# EAGLE design basic-inline-turbidimeter_rtc_board_v1 (EAGLE 7.7.0)
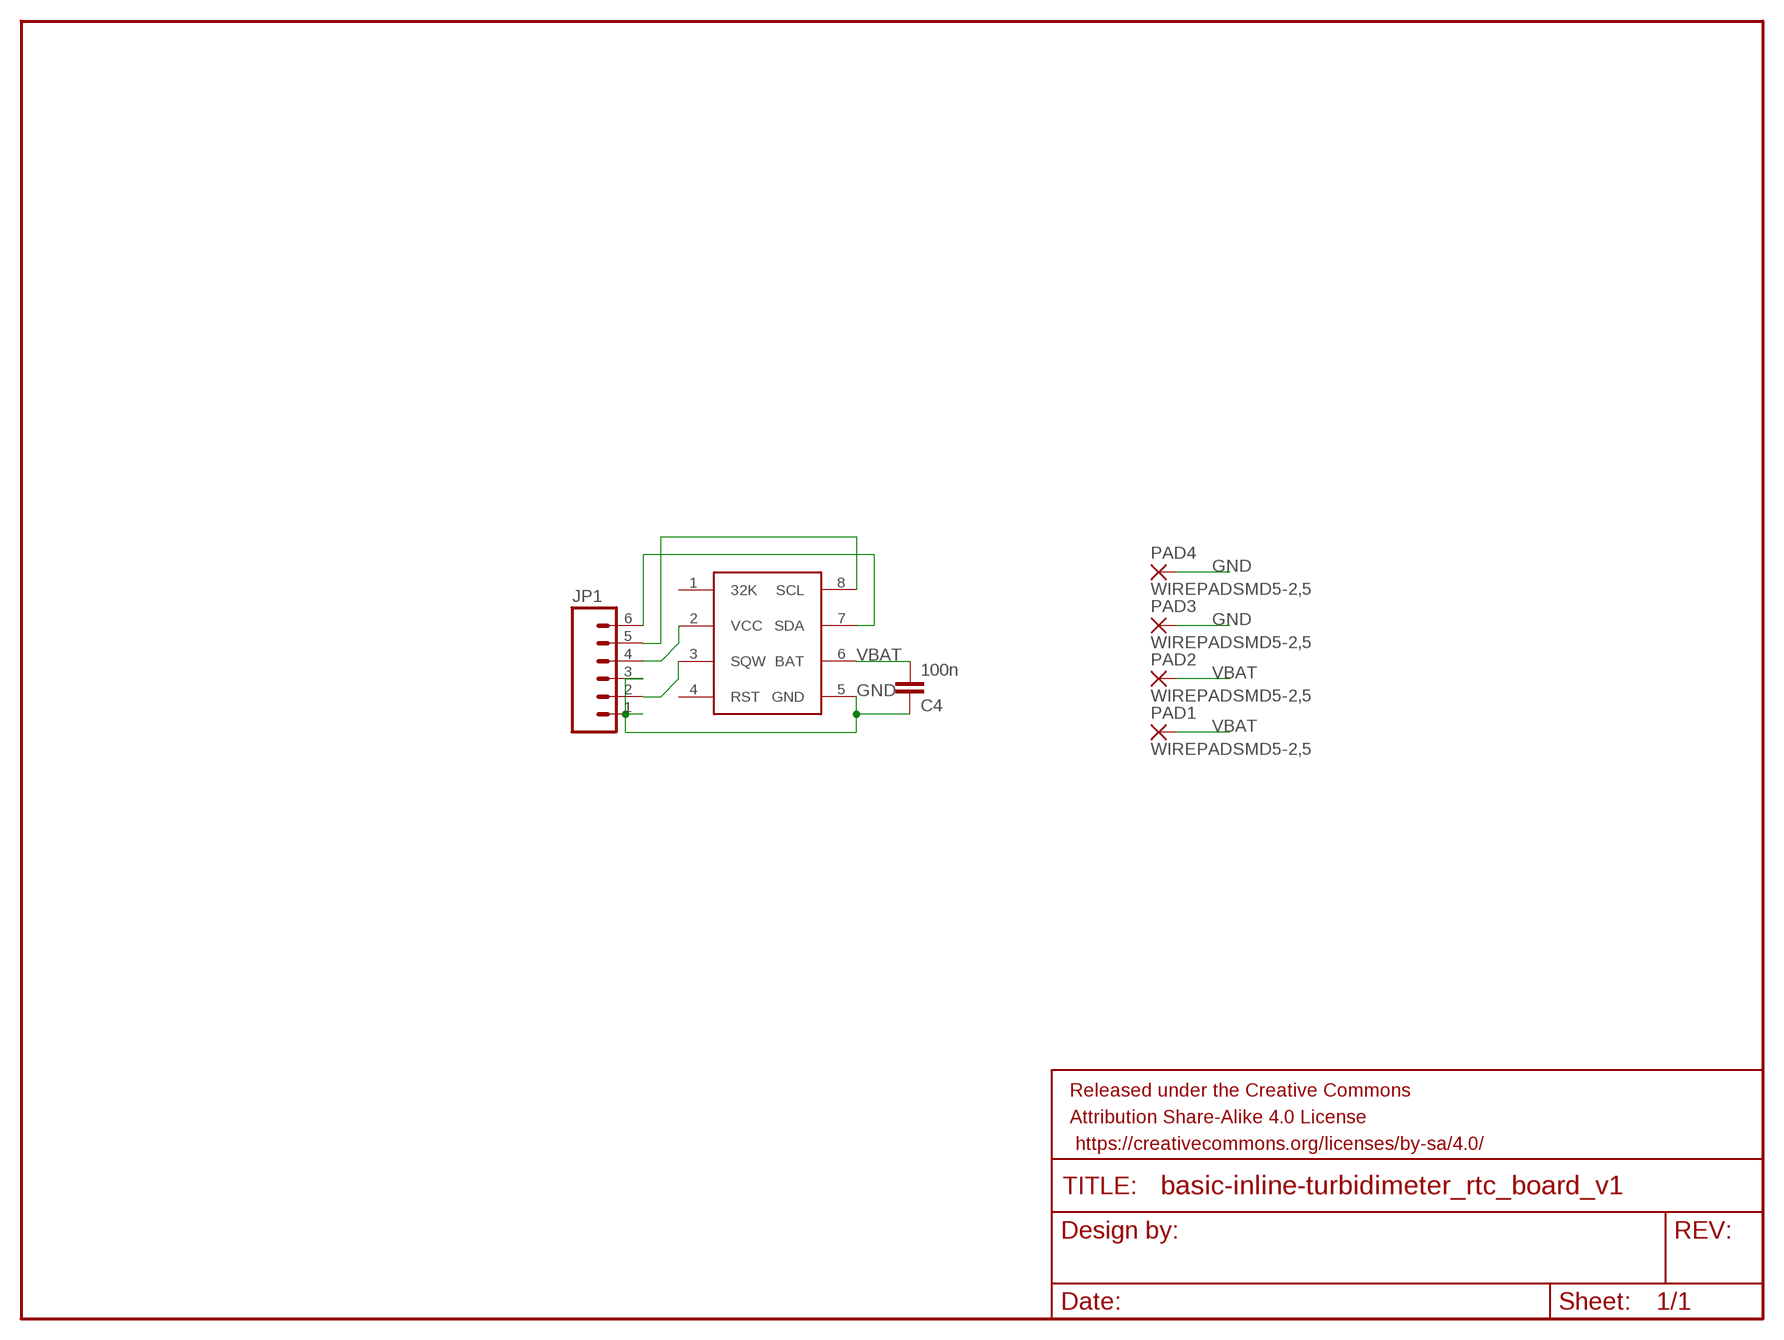
[diagram p0: schematic, sheet 1]

## Parts
*RTC  DS3231M  [DS3231M]
C4  100n  CAP0603-CAP  [0603-CAP]
FRAME1  FRAME-LETTER  [CREATIVE_COMMONS]
JP1  M06SILK_FEMALE_PTH  [1X06]
PAD1  WIREPADSMD5-2,5  [5-2,5]
PAD2  WIREPADSMD5-2,5  [5-2,5]
PAD3  WIREPADSMD5-2,5  [5-2,5]
PAD4  WIREPADSMD5-2,5  [5-2,5]

## Nets
GND: *RTC.5(GND) C4.1 JP1.1 JP1.3 PAD3.1(P) PAD4.1(P)
N$1: *RTC.3(SQW) JP1.2
SCL: *RTC.8(SCL) JP1.5
SDA: *RTC.7(SDA) JP1.6
VBAT: *RTC.6(BAT) C4.2 PAD1.1(P) PAD2.1(P)
VCC: *RTC.2(VCC) JP1.4
Unconnected: *RTC.1(32K) *RTC.4(RST)

## Library data of the parts
*RTC = open_source_turbidimeter:DS3231M
C4 = SparkFun:CAP: Capacitor Standard 0603 ceramic capacitor, and 0.1" leaded capacitor.
FRAME1 = SparkFun-Aesthetics:FRAME-LETTER: Schematic Frame Standard 8.5x11 US Letter frame
JP1 = SparkFun-Connectors:M06: Header 6 Standard 6-pin 0.1" header. Use with straight break away headers (SKU : PRT-00116), right angle break away headers (PRT-00553), swiss pins (PRT-00743), machine pins (PRT-00117), and female headers (PRT-00115). Molex polarized connector foot print use with SKU : PRT-08094 with associated crimp pins and housings. NOTES ON THE VARIANTS LOCK and LOCK_LONGPADS... This footprint was designed to help hold the alignment of a through-hole component (i.e. 6-pin header) while soldering it into place. You may notice that each hole has been shifted either up or down by 0.005 of an inch from it's more standard position (which is a perfectly straight line). This slight alteration caused the pins (the squares in the middle) to touch the edges of the holes. Because they are alternating, it causes a "brace" to hold the component in place. 0.005 has proven to be the perfect amount of "off-center" position when using our standard breakaway headers. Although looks a little odd when you look at the bare footprint, once you have a header in there, the alteration is very hard to notice. Also,if you push a header all the way into place, it is covered up entirely on the bottom side. This idea of altering the position of holes to aid alignment will be further integrated into the Sparkfun Library for other footprints. It can help hold any component with 3 or more connection pins.; PROD_ID: CONN-08437
PAD1-PAD4 = wirepad:WIREPAD: Wire PAD connect wire on PCB

## Board
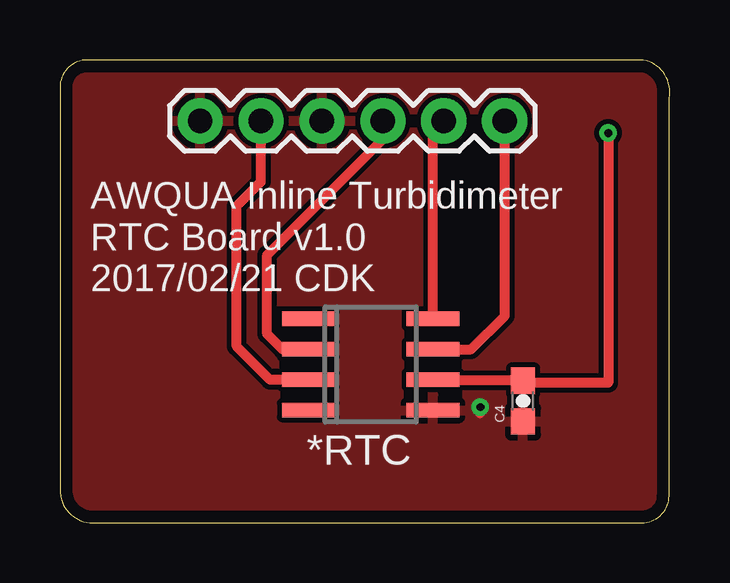
[diagram p1: board, top side]
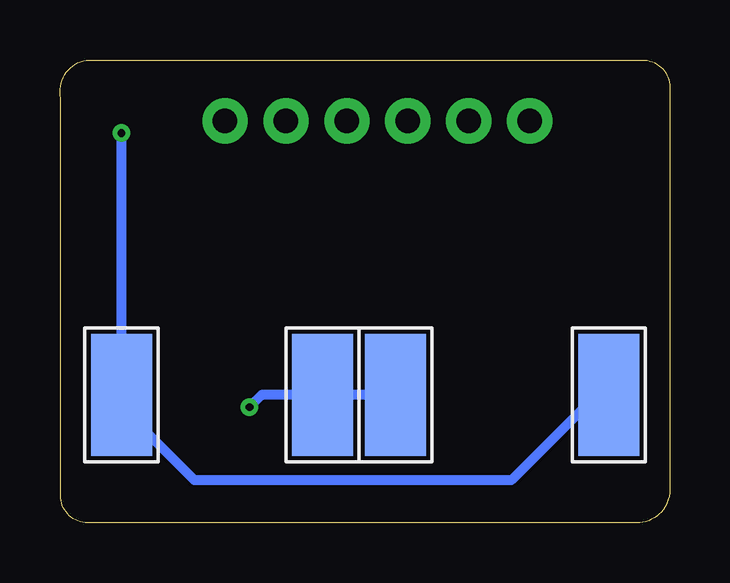
[diagram p2: board, bottom side, seen from below]

Size 25.42 x 19.3 mm. Coordinates in mm from the lower left corner, seen from the top.
Outline: 0,18.17 0,1.37 arc90 1.37,0 24.26,0 arc90 25.4,1.14 25.4,17.72 arc90 24.32,19.3 1.14,19.3 arc90 0,18.17
Copper layers (1*16): Top 0.035mm / dielectric 1.5mm / Bottom 0.035mm
Design rules "default *": minimum track width 10mil, minimum drill 24mil, track to track 8mil, track to pad 8mil, pad to pad 8mil, via to via 8mil, smd to smd 8mil, copper to edge 20mil, drill to drill 8mil, minimum pad ring 10mil, minimum via ring 8mil, stop-mask expansion 4mil, vias tented up to drill 13mil, thermal gap 10mil

### Footprints (pad centres in the part's own frame; a part is rotated, then mirrored left to right if it is on the bottom)
DS3231M = smd 2.2 x 0.6: 1 -2.6,1.905; 2 -2.6,0.635; 3 -2.6,-0.635; 4 -2.6,-1.905; 5 2.6,-1.905; 6 2.6,-0.635; 7 2.6,0.635; 8 2.6,1.905
0603-CAP = smd 1.1 x 1: 1 -0.85,0; 2 0.85,0
1X06 = drill 1.016 pad 1.88: 1 0,0; 2 2.54,0; 3 5.08,0; 4 7.62,0; 5 10.16,0; 6 12.7,0
5-2,5 = smd 2.54 x 5.08: 1 0,0

### Placement (x,y rotation side)
*RTC  12.95,6.6 0 top
C4  19.3,5.08 90 top
FRAME1  -12.19,-10.16 0 top  (outside the outline)
JP1  5.84,16.76 0 top
PAD1  22.86,5.33 0 bottom
PAD2  2.54,5.33 0 bottom
PAD3  14.48,5.33 0 bottom
PAD4  11.43,5.33 180 bottom

### Tracks (layer width: path | path; a pad name or v marks a point on that pad's centre or on a via)
GND  (via drill 0.33)
  Top 0.406: v17.53,4.83 17.53,4.57
  Bottom 0.406: v17.53,4.83 17.02,5.33 PAD3.1 PAD4.1
  pour Top: -2.54,21.08 27.94,21.08 27.94,-1.78 -2.54,-1.78
N$1
  Top 0.406: *RTC.3 8.76,5.97 7.37,7.37 7.37,13.21 8.38,14.22 JP1.2
SCL
  Top 0.406: *RTC.8 15.55,16.06 JP1.5
SDA
  Top 0.406: *RTC.7 17.14,7.24 18.54,8.64 JP1.6
VBAT  (via drill 0.33)
  Top 0.406: v22.86,16.26 22.86,5.84 19.39,5.84 C4.2 15.59,5.93 *RTC.6
  Bottom 0.406: v22.86,16.26 PAD1.1 22.61,5.08 22.61,4.57 19.81,1.78 6.6,1.78 3.05,5.33 PAD2.1
VCC
  Top 0.406: *RTC.2 9.27,7.24 8.64,7.87 8.64,11.18 13.46,16 JP1.4

### Text on the board
tPlace: AWQUA Inline Turbidimeter / RTC Board v1.0 / 2017/02/21 CDK